# EAGLE schematic m3_dct_shift_lights (EAGLE 7.5.0)
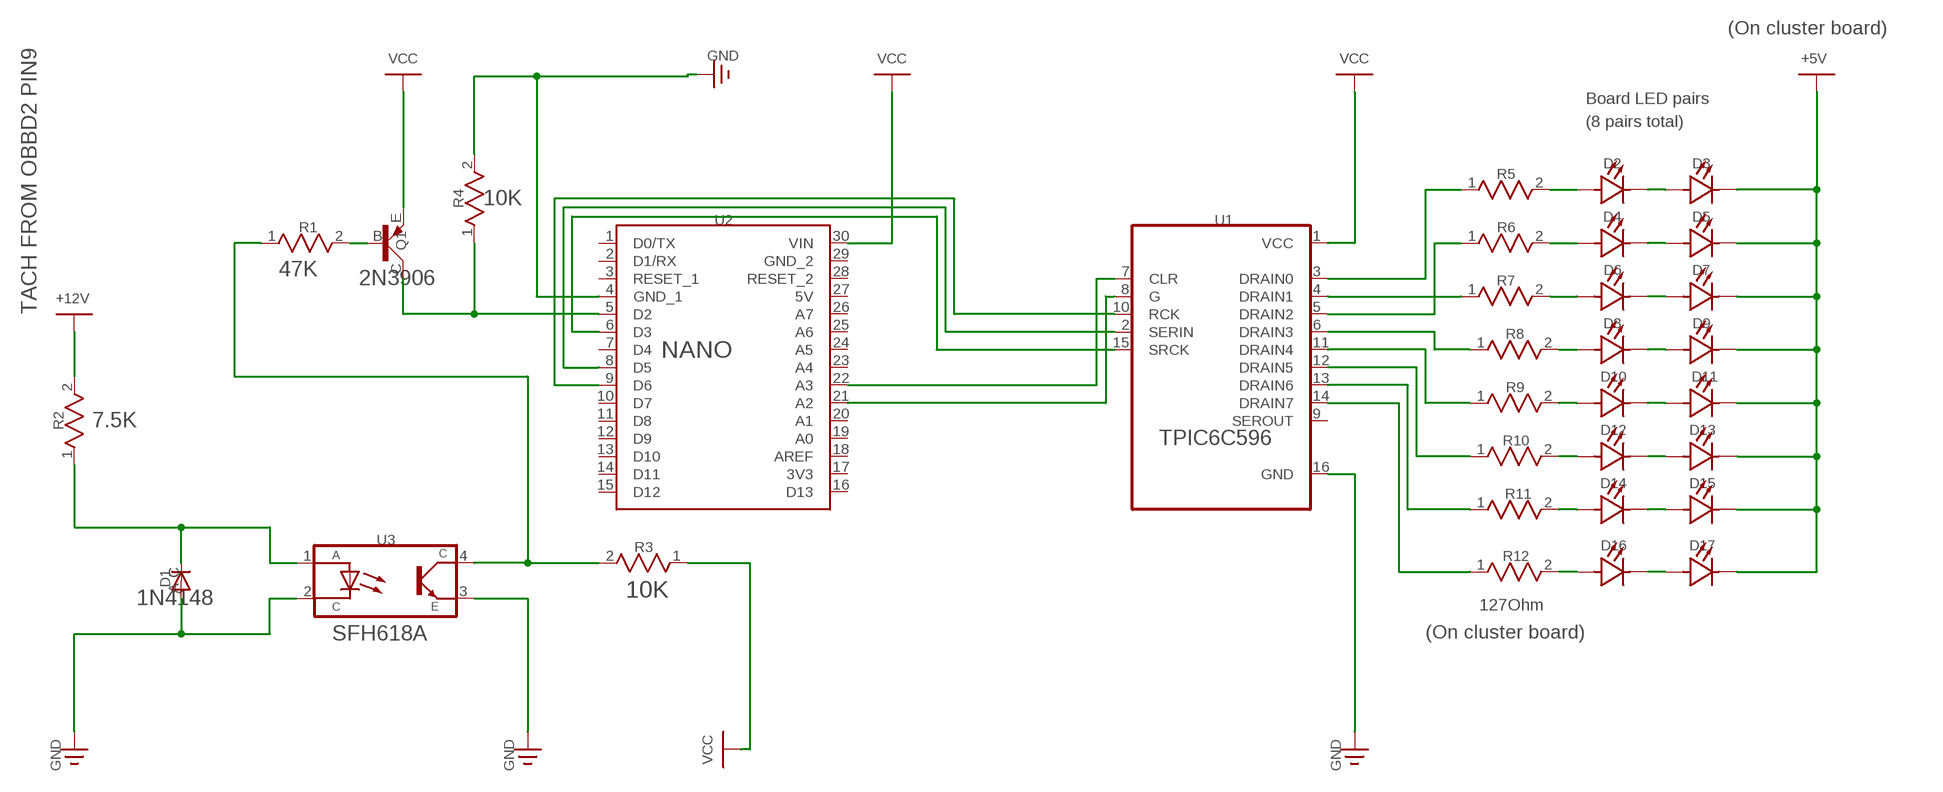
[diagram p0: schematic, sheet 1]

## Parts
D1  1N4148  [DO35-10]
D2  DIO_LED_1  (no package)
D3  DIO_LED_1  (no package)
D4  DIO_LED_1  (no package)
D5  DIO_LED_1  (no package)
D6  DIO_LED_1  (no package)
D7  DIO_LED_1  (no package)
D8  DIO_LED_1  (no package)
D9  DIO_LED_1  (no package)
D10  DIO_LED_1  (no package)
D11  DIO_LED_1  (no package)
D12  DIO_LED_1  (no package)
D13  DIO_LED_1  (no package)
D14  DIO_LED_1  (no package)
D15  DIO_LED_1  (no package)
D16  DIO_LED_1  (no package)
D17  DIO_LED_1  (no package)
Q1  2N3906  [TO92D]
R1  CFR1WSJT-52-10K  [RESAD1490W55L950D360_AD1]
R2  CFR1WSJT-52-10K  [RESAD1490W55L950D360_AD1]
R3  CFR1WSJT-52-10K  [RESAD1490W55L950D360_AD1]
R4  CFR1WSJT-52-10K  [RESAD1490W55L950D360_AD1]
R5  ALSR0110R00JE12  [RESAD1640W50L1112D360]
R6  ALSR0110R00JE12  [RESAD1640W50L1112D360]
R7  ALSR0110R00JE12  [RESAD1640W50L1112D360]
R8  ALSR0110R00JE12  [RESAD1640W50L1112D360]
R9  ALSR0110R00JE12  [RESAD1640W50L1112D360]
R10  ALSR0110R00JE12  [RESAD1640W50L1112D360]
R11  ALSR0110R00JE12  [RESAD1640W50L1112D360]
R12  ALSR0110R00JE12  [RESAD1640W50L1112D360]
U1  TPIC6C596N  [DIP794W45P254L1969H508Q16]
U2  A000005  [MODULE_A000005]
U3  SFH618A-2  [DIP762W50P254L458H480Q4]

## Nets
Net_0: U1.15(SRCK) U2.6(D3)
Net_1: U1.2(SERIN) U2.8(D5)
Net_2: U1.10(RCK) U2.9(D6)
Net_3: U1.7(CLR) U2.22(A3)
Net_4: U1.8(G) U2.21(A2)
Net_5: Q1.C R4.1 U2.5(D2)
Net_6: D1.C R2.1 U3.1(A)
Net_7: D1.A R4.2 U1.16(GND) U2.4(GND_1) U3.2(C) U3.3(E) ; supply symbol labelled GND
Net_8: Q1.B R1.2
Net_9: R1.1 R3.2 U3.4(CO)
Net_10: Q1.E R3.1 U1.1(VCC) U2.30(VIN) ; supply symbol labelled VCC
Net_11: R2.2 ; supply symbol labelled +12V
Net_12: D2.A R5.2
Net_13: D4.A R6.2
Net_14: D6.A R7.2
Net_15: D8.A R8.2
Net_16: D10.A R9.2
Net_17: D12.A R10.2
Net_18: D14.A R11.2
Net_19: D16.A R12.2
Net_20: R12.1 U1.14(DRAIN7)
Net_21: R11.1 U1.13(DRAIN6)
Net_22: R10.1 U1.12(DRAIN5)
Net_23: R9.1 U1.11(DRAIN4)
Net_24: R8.1 U1.6(DRAIN3)
Net_25: R7.1 U1.5(DRAIN2)
Net_26: R6.1 U1.4(DRAIN1)
Net_27: R5.1 U1.3(DRAIN0)
Net_28: D16.K D17.A
Net_29: D14.K D15.A
Net_30: D12.K D13.A
Net_31: D10.K D11.A
Net_32: D8.K D9.A
Net_33: D6.K D7.A
Net_34: D4.K D5.A
Net_35: D2.K D3.A
Net_36: D3.K D5.K D7.K D9.K D11.K D13.K D15.K D17.K ; supply symbol labelled +5V
Unconnected: U1.9(SEROUT) U2.1(D0/TX) U2.2(D1/RX) U2.3(RESET_1) U2.7(D4) U2.10(D7) U2.11(D8) U2.12(D9) U2.13(D10) U2.14(D11) U2.15(D12) U2.16(D13) U2.18(AREF) U2.19(A0) U2.20(A1) U2.23(A4) U2.24(A5) U2.25(A6) U2.26(A7) U2.28(RESET_2)

## Notes on the sheet
- (On cluster board)
- VCC | GND | VCC | VCC | +5V
- Board LED pairs
  (8 pairs total)
- D2 | D3
- R5
- 10K
- R4
- U2 | U1 | D4 | D5
- R1 | R6
- Q1
- 47K
- 2N3906
- D6 | D7
- R7
- +12V
- TACH FROM OBBD2 PIN9
- D8 | D9
- NANO | R8
- D10 | D11
- R9
- 7.5K
- R2 | TPIC6C596
- D12 | D13
- R10
- D14 | D15
- R11
- U3
- R3 | D16 | D17
- A | C
- R12
- 10K
- 1N4148 | D1
- 127Ohm
- E
- C
- SFH618A | (On cluster board)
- VCC
- GND | GND | GND

## Power pins joined to a net without a drawn wire
3V3: U2.17(3V3)
5V: U2.27(5V)
GND_2: U2.29(GND_2)

## Library data of the parts
D1 = common:1N4148; DESCRIPTION: Diode Standard 75V 300mA (DC) Through Hole DO-35
D2-D17 = common:DIO_LED_1; DESCRIPTION: LED
Q1 = common:2N3906; DESCRIPTION: Trans GP BJT PNP 40V 0.2A 625mW Automotive 3-Pin TO-92 Ammo
R1-R4 = common:CFR1WSJT-52-10K; DATASHEET: http://datasheets.diptrace.com/yageo/cfr.pdf; MANUFACTURER: Yageo; PART_NUMBER_(DIGI-KEY): CFR1WSJT-52-10K-ND; UNIQUE_NAME: YAGEO_CFR1WS
R5-R12 = common:ALSR0110R00JE12; DATASHEET: http://datasheets.diptrace.com/vishay/alsralvr.pdf; MANUFACTURER: Vishay; PART_NUMBER_(DIGI-KEY): ALSR1J-10-ND; UNIQUE_NAME: VISHAY_ALSR01
U1 = common:TPIC6C596N; DESCRIPTION: Automotive 8-bit shift register 16-PDIP -40 to 125
U2 = common:A000005; DESCRIPTION: ATmega328 Arduino Nano AVR® ATmega AVR MCU 8-Bit Embedded Evaluation Board
U3 = common:SFH618A-2; DESCRIPTION: Optoisolator Transistor Output 5300Vrms 1 Channel 4-DIP